# Altium schematic sheet GroundInd.SchDoc
size A2
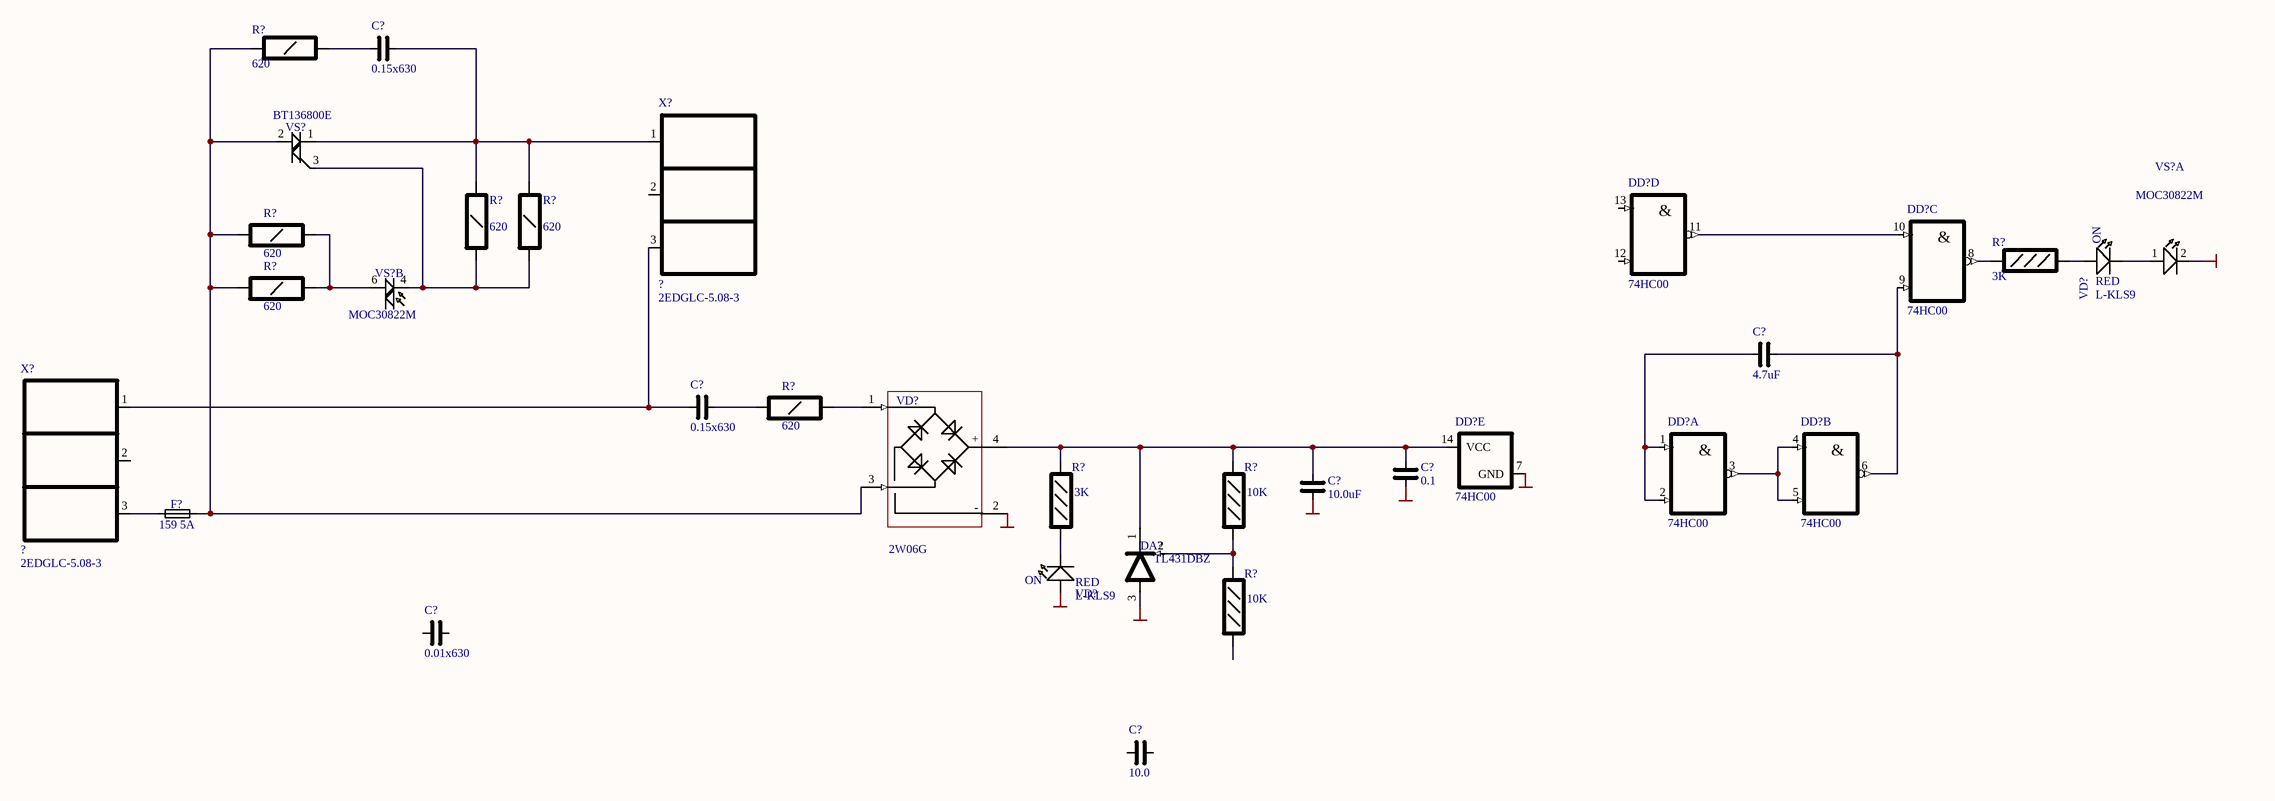
[diagram p0: GroundInd.SchDoc]

## Parts
(Parts that share a designator on the sheet are numbered #1, #2 ... from top to bottom, then left to right.)
C?#1  0.15x630  [CAPR3750-1700X4150X2900]
C?#2  4.7uF  [CAPC3225X168N]
C?#3  0.15x630  [CAPR3750-1700X4150X2900]
C?#4  0.1  [CAPC1608X85N]
C?#5  10.0uF  [CAPC3225X168N]
C?#6  0.01x630  [CAPR2750-1100X3150X2100]
C?#7  10.0  [CAPC3225X168N]
DA?  TL431DBZ  [SOT23-95]
DD?#1  74HC00  [SOIC_14-127]  (part D of 5)
DD?#2  74HC00  [SOIC_14-127]  (part C of 5)
DD?#3  74HC00  [SOIC_14-127]  (part A of 5)
DD?#4  74HC00  [SOIC_14-127]  (part B of 5)
DD?#5  74HC00  [SOIC_14-127]  (part E of 5)
F?  159 5A  [FUSE_LITTELFUSE_0159]
R?#1  620  [RESC3225X70N]
R?#2  620  [RESC3225X70N]
R?#3  620  [RESC3225X70N]
R?#4  620  [RESC3225X70N]
R?#5  3K  [RESC1608X50N]
R?#6  620  [RESC3225X70N]
R?#7  620  [RESC3225X70N]
R?#8  3K  [RESC1608X50N]
R?#9  10K  [RESC1608X50N]
R?#10  10K  [RESC1608X50N]
VD?#1  ON  Color: RED  Device: L-KLS9  [LED0603]
VD?#2  2W06G  [DIP_4-500]
VD?#3  ON  Color: RED  Device: L-KLS9  [LED0603]
VS?#1  BT136800E  [TO-220-v]
VS?#2  MOC30822M  [DIP6-254]  (part A of 2)
VS?#3  MOC30822M  [DIP6-254]  (part B of 2)
X?#1  ?  [SIP-EEDGLC-5,08]
X?#2  ?  [SIP-EEDGLC-5,08]

## Nets
GND: C?#4.1 C?#5.1 DA?.3(A) DD?#5.7(GND) VD?#2.2(-) VD?#3.2(A) VS?#2.2(C)
NetC?#1_1: C?#1.1 R?#1.1
NetC?#1_2: C?#1.2 R?#3.2 R?#4.2 VS?#1.1(T2) X?#1.1
NetC?#2_1: C?#2.1 DD?#2.9(in2) DD?#4.6(OUT)
NetC?#2_2: C?#2.2 DD?#3.1(in1) DD?#3.2(in2)
NetC?#3_1: C?#3.1 X?#1.3 X?#2.1
NetC?#3_2: C?#3.2 R?#7.1
NetC?#4_2: C?#4.2 C?#5.2 DA?.1(C) DD?#5.14(VCC) R?#8.2 R?#9.2 VD?#2.4(+)
NetDA?_2: DA?.2(Ref) R?#9.1 R?#10.2
NetDD?#1_11: DD?#1.11(OUT) DD?#2.10(in1)
NetDD?#2_8: DD?#2.8(OUT) R?#5.2
NetDD?#3_3: DD?#3.3(OUT) DD?#4.4(in1) DD?#4.5(in2)
NetF?_1: F?.1 X?#2.3
NetF?_2: F?.2 R?#1.2 R?#2.1 R?#6.1 VD?#2.3(AC) VS?#1.2(T1)
NetR?#2_2: R?#2.2 R?#6.2 VS?#3.6(T2)
NetR?#3_1: R?#3.1 R?#4.1 VS?#1.3(G) VS?#3.4(T1)
NetR?#5_1: R?#5.1 VD?#1.2(A)
NetR?#7_2: R?#7.2 VD?#2.1(AC)
NetR?#8_1: R?#8.1 VD?#3.1(C)
NetVD?#1_1: VD?#1.1(C) VS?#2.1(A)

Not connected (* = marked no-connect by the designer): C?#6 1 2; C?#7 1 2; DD?#1 12(in2) 13(in1); R?#10 1; X?#1 2; X?#2 2

## Notes on the sheet
- (in symbol 74HC00, part A) &
- (in symbol 74HC00, part B) &
- (in symbol 74HC00, part C) &
- (in symbol 74HC00, part D) &

## Library data of the parts
C?#1 C?#3 = K17-1: polymer capacitor; Vendor: Vishay; Unit Price: 0.3; Package: spec; Value: 0.15x630; Device: K17-1
C?#2 C?#5 C?#7 = CAP1210: Chip capasitor 1210; Vendor: Vishay; Unit Price: 0.1; Package: SMD1210
  C?#2: Value: 4.7uF
  C?#5: Value: 10.0uF
  C?#7: Value: 10.0
C?#4 = CAP00603: Chip capasitor 0603; Vendor: Vishay; Unit Price: 0.1; Package: 0603; Value: 0.1
C?#6 = K17-2: Polymer capacitor; Vendor: Vishay; Unit Price: 0.3; Package: spec; Value: 0.01x630; Device: K17-2
DA? = TL431DBZ: Adjustable voltage reference; Vendor: TI; Package: SOT23; Unit Price: 1; Device: TL431DBZ
DD?#1-DD?#5 = 74HC00: Quad 2 inverted AND; Vendor: NXP; Package: SOIC14; Unit Price: 0.2; Device: 74HC00
F? = 159: Fuse; Vendor: lITTELfUSE; Paccage: SIP_2-508; Unit Price: 0,3; Device: 159; Value: 5A
R?#1-R?#4 R?#6 R?#7 = Res1210: Chip resistor 1210; Group: Passive; Vendor: Vishay; Unit Price: 0.005; Descr: Chip resistor 1210; Package: SMD1210; Value: 620
R?#5 R?#8-R?#10 = Res0603: Chip resistor 0603; Group: Passive; Vendor: Vishay; Unit Price: 0.005; Descr: Chip resistor 0603; Package: SMD0603
  R?#5 R?#8: Value: 3K
  R?#9 R?#10: Value: 10K
VD?#1 VD?#3 = L-KLS9-T0603: Chip LED SMD 0603; Vendor: NINGBO KLS ELECTRONIC CO LTD; Value: ON; Package: SMD0603; Unit Price: 0.1
VD?#2 = 2W: 2Amp. Bridge Rectifier; Vendor: Vishay; Value: 06G; Device: 2W; Package: Spec DIP4; UnitPrice: 0,2
VS?#1 = BT136: Passivated, sensitive gate triac; Vendor: Phillips; Value: 800; Package: TO220; Unit Price: 1; Device: BT136
VS?#2 VS?#3 = MOC308: Zero-cross optoisolators triac driver output; Vendor: Phillips; Value: 2; Package: DIP6; Unit Price: 0.5; Device: MOC3082
X?#1 X?#2 = 2EDGLC-5.08-3: 4 pin TRH connector 5.08mm pitch 45 grad angle; Vendor: DEGSON; Pckage: spec SIP  pitch 5.08; Unit Price: 1; Value: ?; Device: 2EDGLC-5.08-3